# EAGLE design BR216_MKL_3075_Lichtplatine_V4 (EAGLE 5.10)
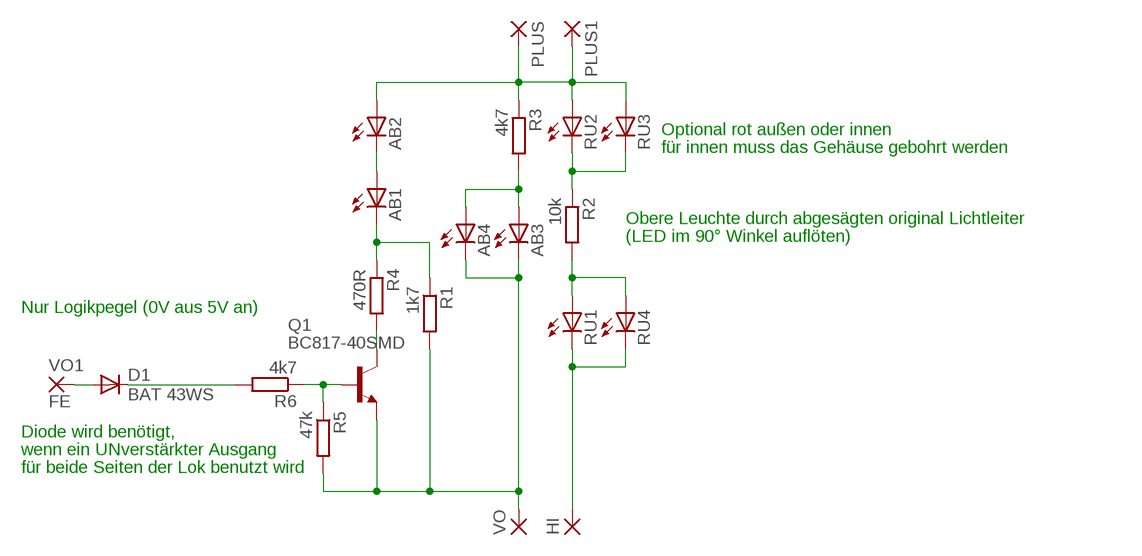
[diagram p0: schematic, sheet 1]

## Parts
AB1  LEDCHIP-LED0603  [CHIP-LED0603]
AB2  LEDCHIP-LED0603  [CHIP-LED0603]
AB3  LEDCHIP-LED0603  [CHIP-LED0603]
AB4  LEDCHIPLED_1206  [CHIPLED_1206]
D1  BAT 43WS  DIODE-SOD323-R2  [SOD323-R2]
HI  SMD2  [SMD1,27-2,54]
PLUS  SMD2  [SMD1,27-2,54]
PLUS1  SMD2  [SMD1,27-2,54]
Q1  BC817-40SMD  [SOT23-BEC]
R1  1k7  R-EU_R0603  [R0603]
R2  10k  R-EU_R0603  [R0603]
R3  4k7  R-EU_R0603  [R0603]
R4  470R  R-EU_R0603  [R0603]
R5  47k  R-EU_R0603  [R0603]
R6  4k7  R-EU_R0603  [R0603]
RU1  LEDCHIP-LED0603  [CHIP-LED0603]
RU2  LEDCHIP-LED0603  [CHIP-LED0603]
RU3  LEDCHIP-LED0603  [CHIP-LED0603]
RU4  LEDCHIP-LED0603  [CHIP-LED0603]
VO  SMD2  [SMD1,27-2,54]
VO1  FE  SMD2  [SMD1,27-2,54]

## Nets
N$1: AB1.A AB2.C
N$2: AB3.C AB4.C Q1.E R1.2 R5.2 VO.1(P)
N$3: AB1.C R1.1 R4.1
N$4: AB3.A AB4.A R3.2
N$5: Q1.C R4.2
N$6: R2.2 RU1.A RU4.A
N$7: R2.1 RU2.C RU3.C
N$8: Q1.B R5.1 R6.1
N$9: D1.C R6.2
N$10: D1.A VO1.1(P)
N$13: HI.1(P) RU1.C RU4.C
PLUS: AB2.A PLUS1.1(P) PLUS.1(P) R3.1 RU2.A RU3.A

## Notes on the sheet
- Optional rot außen oder innen
- für innen muss das Gehäuse gebohrt werden
- Obere Leuchte durch abgesägten original Lichtleiter
- (LED im 90° Winkel auflöten)
- Nur Logikpegel (0V aus 5V an)
- Diode wird benötigt,
- wenn ein UNverstärkter Ausgang
- für beide Seiten der Lok benutzt wird

## Library data of the parts
AB1-AB4 RU1-RU4 = led:LED: LED OSRAM: - CHIPLED LG R971, LG N971, LY N971, LG Q971, LY Q971, LO R971, LY R971 LH N974, LH R974 LS Q976, LO Q976, LY Q976 LO Q996 - Hyper CHIPLED LW Q18S LB Q993, LB Q99A, LB R99A - SideLED LS A670, LO A670, LY A670, LG A670, LP A670 LB A673, LV A673, LT A673, LW A673 LH A674 LY A675 LS A676, LA A676, LO A676, LY A676, LW A676 LS A679, LY A679, LG A679 - Hyper Micro SIDELED® LS Y876, LA Y876, LO Y876, LY Y876 LT Y87S - SmartLED LW L88C, LW L88S LB L89C, LB L89S, LG L890 LS L89K, LO L89K, LY L89K LS L896, LA L896, LO L896, LY L896 - TOPLED LS T670, LO T670, LY T670, LG T670, LP T670 LSG T670, LSP T670, LSY T670, LOP T670, LYG T670 LG T671, LOG T671, LSG T671 LB T673, LV T673, LT T673, LW T673 LH T674 LS T676, LA T676, LO T676, LY T676, LB T676, LH T676, LSB T676, LW T676 LB T67C, LV T67C, LT T67C, LS T67K, LO T67K, LY T67K, LW E67C LS E67B, LA E67B, LO E67B, LY E67B, LB E67C, LV E67C, LT E67C LW T67C LS T679, LY T679, LG T679 LS T770, LO T770, LY T770, LG T770, LP T770 LB T773, LV T773, LT T773, LW T773 LH T774 LS E675, LA E675, LY E675, LS T675 LS T776, LA T776, LO T776, LY T776, LB T776 LHGB T686 LT T68C, LB T68C - Hyper Mini TOPLED® LB M676 - Mini TOPLED Santana® LG M470 LS M47K, LO M47K, LY M47K Source: http://www.osram.convergy.de LUXEON: - LUMILED® LXK2-PW12-R00, LXK2-PW12-S00, LXK2-PW14-U00, LXK2-PW14-V00 LXK2-PM12-R00, LXK2-PM12-S00, LXK2-PM14-U00 LXK2-PE12-Q00, LXK2-PE12-R00, LXK2-PE12-S00, LXK2-PE14-T00, LXK2-PE14-U00 LXK2-PB12-K00, LXK2-PB12-L00, LXK2-PB12-M00, LXK2-PB14-N00, LXK2-PB14-P00, LXK2-PB14-Q00 LXK2-PR12-L00, LXK2-PR12-M00, LXK2-PR14-Q00, LXK2-PR14-R00 LXK2-PD12-Q00, LXK2-PD12-R00, LXK2-PD12-S00 LXK2-PH12-R00, LXK2-PH12-S00 LXK2-PL12-P00, LXK2-PL12-Q00, LXK2-PL12-R00 Source: www.luxeon.com KINGBRIGHT: KA-3528ASYC Source: www.kingbright.com
D1 = diode:DIODE-: DIODE
HI PLUS PLUS1 VO VO1 = wirepad:SMD2: SMD PAD
Q1 = transistor-npn:BC817*: NPN Transistor
R1-R6 = rcl:R-EU_: RESISTOR, European symbol

## Board
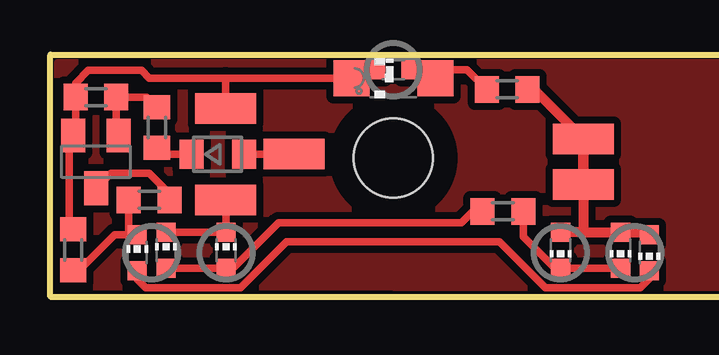
[diagram p1: board, top side]
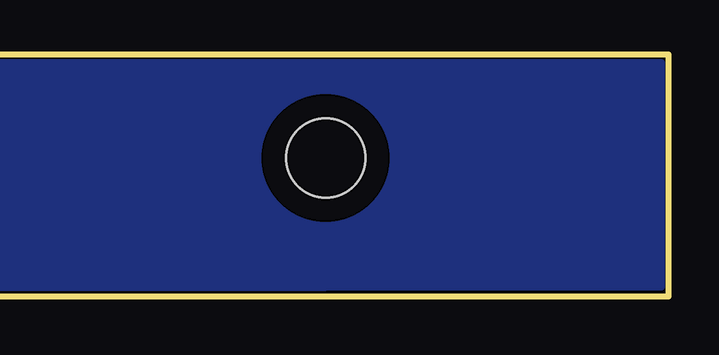
[diagram p2: board, bottom side, seen from below]

No outline drawn. Coordinates in mm, seen from the top.
Copper layers (1*16): Top 0.035mm / dielectric 1.5mm / Bottom 0.035mm
Design rules "default *": minimum track width 7mil, minimum drill 0.6mm, track to track 8mil, track to pad 8mil, pad to pad 8mil, via to via 8mil, smd to smd 8mil, copper to edge 40mil, drill to drill 8mil, minimum pad ring 10mil, minimum via ring 8mil, stop-mask expansion 4mil, vias tented up to drill 0mil, thermal gap 10mil
Holes 3.3 mm at 14.3,5.77
Milling: 4 lines

### Footprints (pad centres in the part's own frame; a part is rotated, then mirrored left to right if it is on the bottom)
CHIP-LED0603 = smd 0.8 x 0.8: A 0,-0.75; C 0,0.75
CHIPLED_1206 = smd 1.5 x 1.5: A 0,-1.75; C 0,1.75
SOD323-R2 = smd 1 x 1.2: A 1.1,0; C -1.1,0
SMD1,27-2,54 = smd 1.27 x 2.54: 1 0,0
SOT23-BEC = smd 1 x 1.4: B -0.95,-1.1; C 0,1.1; E 0.95,-1.1
R0603 = smd 1 x 1.1: 1 -0.85,0; 2 0.85,0

### Placement (x,y rotation side)
AB1  3.62,1.83 0 top
AB2  24.98,1.83 180 top
AB3  14.3,9.45 90 top
AB4  14.3,9.11 90 top
D1  6.99,5.93 0 top
HI  7.3,4.03 270 top
PLUS  22.23,6.57 270 top
PLUS1  22.23,4.66 270 top
Q1  1.91,5.61 180 top
R1  0.95,1.95 90 top
R2  18.87,3.55 180 top
R3  19.05,8.63 180 top
R4  4.13,4.03 0 top
R5  1.9,8.31 180 top
R6  4.45,7.04 270 top
RU1  7.33,1.93 0 top
RU2  21.27,1.93 180 top
RU3  23.77,1.93 180 top
RU4  4.83,1.93 0 top
VO  7.3,7.84 270 top
VO1  10.16,5.93 270 top

### Tracks (layer width: path | path; a pad name or v marks a point on that pad's centre or on a via)
N$1
  Top 0.305: AB1.A 3.62,0.72 3.97,0.38 7.94,0.38 9.84,2.28 18.73,2.28 20.64,0.38 24.61,0.38 24.98,0.74 AB2.C
N$2
  Top 0.305: AB3.C 13.21,9.11 AB4.C 7.3,9.11 | 7.3,9.11 4.13,9.11 3.81,9.43 1.59,9.43 1.05,8.89 R5.2 1.05,6.82 Q1.E 0.95,6.41 0.79,6.25 0.79,2.96 R1.2 | 7.3,9.11 VO.1
N$3
  Top 0.305: R1.1 1.2,1.1 2.68,2.58 3.28,2.58 | 3.28,2.58 AB1.C | 3.28,2.58 R4.1
N$4
  Top 0.305: AB4.A 15.39,9.11 AB3.A 17.38,9.45 R3.2
N$5
  Top 0.305: Q1.C 2.53,5.14 4.13,5.14 4.98,4.29 R4.2
N$6
  Top 0.305: RU4.A RU1.A 7.63,1.18 9.53,3.08 17.14,3.08 17.62,3.55 R2.2
N$7
  Top 0.305: RU3.C RU2.C 21.05,1.18 19.72,2.5 R2.1
N$8
  Top 0.305: Q1.B 2.75,6.82 R5.1 4.03,8.31 R6.1
N$9
  Top 0.305: D1.C 4.71,5.93 R6.2
N$10
  Top 0.305: D1.A VO1.1
N$13
  Top 0.254: 7.33,4 HI.1
  Top 0.305: RU4.C RU1.C 7.33,4
N$14
  pour Bottom (isolate 0.305): 0.32,0.4 28.26,0.38 28.26,9.74 0.32,9.74 0.32,9.74
  pour Top (isolate 0.305): 0.32,0.4 28.26,0.38 28.26,9.74 0.32,9.74 0.32,9.74
PLUS
  Top 0.406: R3.1 20.16,8.63 PLUS.1 | PLUS1.1 PLUS.1 | PLUS.1 22.23,2.68 | 22.23,2.68 RU3.A 24.88,2.68 AB2.A | 22.23,2.68 RU2.A

### Text on the board
tStop: vo | Fl | + | hi | BR216 LED
bStop: Für Märklin 3075 | BR216 LED | design by Janik Merz